# Altium schematic sheet conn_fan.SchDoc
size A
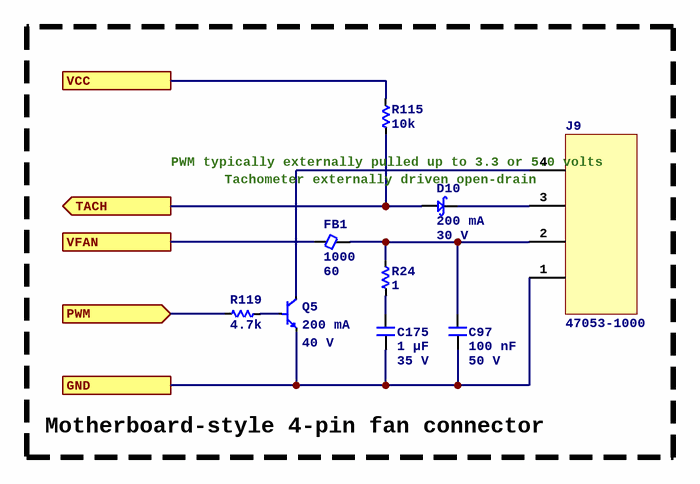
[diagram p0: conn_fan.SchDoc]

## Parts
C97  Capacitance: 100 nF  Voltage Rating: 50 V  [C0402]  (hidden comment: CL05B104KB54PNC)
C175  Capacitance: 1 µF  Voltage Rating: 35 V  [C0603]  (hidden comment: GMK107AB7105KAHT)
D10  Current: 200 mA  Vr: 30 V  [SOD523]  (hidden comment: BAT54XV2T1G)
FB1  Current Rating (mA): 1000  Z @ 100 MHz: 60  [FB0805]  (hidden comment: MGGB2012M600HT-LF)
J9  47053-1000  [MOLEX_KK254_4POS_VERT_0470531000]
Q5  Current: 200 mA  Voltage: 40 V  [3SOT523]  (hidden comment: MMBT3904T)
R24  value 1  [R0402]  (hidden comment: CRCW04021R00FKEDC)
R115  value 10k  [R0402]  (hidden comment: 0402WGF1002TCE)
R119  value 4.7k  [R0402]  (hidden comment: 0402WGF4701TCE)

## Ports
GND, PWM (in), TACH (out), VCC, VFAN

## Nets
GND: C97.2 C175.2 J9.1 Q5.2(E) ; port GND
PWM: R119.2 ; port PWM
TACH: D10.1 R115.2 ; port TACH
VCC: R115.1 ; port VCC
VFAN: FB1.1 ; port VFAN
NetC97_1: C97.1 FB1.2 J9.2 R24.2
NetC175_1: C175.1 R24.1
NetD10_2: D10.2 J9.3
NetJ9_4: J9.4 Q5.3(C)
NetQ5_1: Q5.1(B) R119.1

## Notes on the sheet
- PWM typically externally pulled up to 3.3 or 5.0 volts
- (near D10) Tachometer externally driven open-drain
- Motherboard-style 4-pin fan connector

## Library data of the parts
C97 = CL05B104KB54PNC: Manufacturer: Samsung Electro-Mechanics; Dielectric: X7R; ComponentLink1URL: https://wmsc.lcsc.com/wmsc/upload/file/pdf/v2/lcsc/2304140030_Samsung-Electro-Mechanics-CL05B104KB54PNC_C307331.pdf; ComponentLink1Description: Datasheet; Manufacturer Part Number: CL05B104KB54PNC; Package: 0402; Supplier 2: LCSC; Supplier Part Number 2: C307331
C175 = GMK107AB7105KAHT: Manufacturer: Taiyo Yuden; Dielectric: X7R; ComponentLink1URL: https://datasheet.lcsc.com/lcsc/2304140030_Taiyo-Yuden-GMK107AB7105KAHT_C841050.pdf; ComponentLink1Description: Datasheet; Manufacturer Part Number: GMK107AB7105KAHT; Package: 0603; Supplier 2: LCSC; Supplier Part Number 2: C841050
D10 = BAT54XV2T1G: ON Semi BAT54XV2T1G; SMT Schottky Diode; 30V 200mA; 5ns; 2-Pin SOD-523; Manufacturer: onsemi; Supplier 1: DigiKey; Supplier Part Number 1: BAT54XV2T1GOSCT-ND; Manufacturer Part Number: BAT54XV2T1G; Supplier 2: LCSC; Supplier Part Number 2: C81572; ComponentLink1Description: Datasheet; ComponentLink1URL: https://www.onsemi.com/pdf/datasheet/bat54xv2t1-d.pdf; Diode Type: Schottky; Supplier 3: Mouser; Supplier Part Number 3: 863-BAT54XV2T1G
FB1 = MGGB2012M600HT-LF: Manufacturer: microgate; DCR (mOhms): 50; ComponentLink1URL: https://wmsc.lcsc.com/wmsc/upload/file/pdf/v2/lcsc/2304140030_microgate-MGGB2012M600HT-LF_C281169.pdf; ComponentLink1Description: Datasheet; Manufacturer Part Number: MGGB2012M600HT-LF; Package: 0805; Supplier 2: LCSC; Supplier Part Number 2: C281169
J9 = 47053-1000: Board Connector, 4 Contact(s), 1 Row(s), Male, Straight, 0.1 inch Pitch, Solder Terminal, Locking, White Insulator, Receptacle; Manufacturer: Molex; Supplier 1: DigiKey; Supplier Part Number 1: WM4330-ND; Manufacturer Part Number: 47053-1000; ComponentLink1URL: https://www.molex.com/content/dam/molex/molex-dot-com/products/automated/en-us/salesdrawingpdf/470/47053/470531000_sd.pdf?inline; ComponentLink1Description: Drawing; ComponentLink2Description: Product page; ComponentLink2URL: https://www.molex.com/en-us/products/part-detail/470531000; Supplier 2: LCSC; Supplier Part Number 2: C240840; Supplier 3: Mouser; Supplier Part Number 3: 538-47053-1000
Q5 = MMBT3904T: Bipolar (BJT) Transistor NPN 40 V 200 mA 300MHz 150 mW Surface Mount SOT-523; Manufacturer: Shenzhen Slkormicro Semicon Co., Ltd.; Supplier 1: DigiKey; Supplier Part Number 1: 5399-MMBT3904TCT-ND; Manufacturer Part Number: MMBT3904T; ComponentLink1Description: Datasheet; ComponentLink1URL: https://mm.digikey.com/Volume0/opasdata/d220001/medias/docus/7136/5399_MMBT3904T%20SOT-523.pdf; Supplier 2: LCSC; Supplier Part Number 2: C61616; Polarity: NPN
R24 = CRCW04021R00FKEDC: Manufacturer: Vishay Intertech; Tolerance: 1%; Temperature Coefficient: ±100ppm/?; Power Rating (mW): 62.5; ComponentLink1Description: Datasheet; ComponentLink1URL: https://datasheet.lcsc.com/lcsc/2304140030_Vishay-Intertech-CRCW04021R00FKEDC_C2077765.pdf; Manufacturer Part Number: CRCW04021R00FKEDC; Package: 0402; Supplier 2: LCSC; Supplier Part Number 2: C2077765
R115 = 0402WGF1002TCE: Manufacturer: UNI-ROYAL(Uniroyal Elec); Tolerance: 1%; Temperature Coefficient: ±100ppm/?; Power Rating (mW): 62.5; ComponentLink1Description: Datasheet; ComponentLink1URL: https://wmsc.lcsc.com/wmsc/upload/file/pdf/v2/lcsc/2206010100_UNI-ROYAL-Uniroyal-Elec-0402WGF1002TCE_C25744.pdf; Manufacturer Part Number: 0402WGF1002TCE; Package: 0402; Supplier 2: LCSC; Supplier Part Number 2: C25744
R119 = 0402WGF4701TCE: Manufacturer: UNI-ROYAL(Uniroyal Elec); Tolerance: 1%; Temperature Coefficient: ±100ppm/?; Power Rating (mW): 62.5; ComponentLink1Description: Datasheet; ComponentLink1URL: https://wmsc.lcsc.com/wmsc/upload/file/pdf/v2/lcsc/2206010045_UNI-ROYAL-Uniroyal-Elec-0402WGF4701TCE_C25900.pdf; Manufacturer Part Number: 0402WGF4701TCE; Package: 0402; Supplier 2: LCSC; Supplier Part Number 2: C25900